# Altium schematic sheet FK723MK1_ZGT6_DSUB.SchDoc: =SAP_Nr_Baugruppe
size A3; Organization: TRUMPF Laser Marking Systems AG; Address1: Trumpf Strasse 8; Address2: CH-7214 Grüsch; Revision: 00; SheetNumber: 1; SheetTotal: 1; Date: 19.03.2018; Author: 19.03.2018; SPICEModelCacheDGJBQTKQ: <root> / <DocumentId>DGJBQTKQ</DocumentId> / <CacheFrame Number="0"> / <Model Name="0603_885012006014_1nf" Kind="CKT"> / <Text>******* / .subckt 0603_885012006014_1nF 1 2 / Rser 1 3 0.0434067925003 / Lser 2 4 4.09321859E-10 / C1 3 4 0.000000001 / Rpar 3 4 10000000000 / .ends 0603_885012006014_1nF</Text> / </Model> / </CacheFrame> / </root>; Time: 19.03.2018
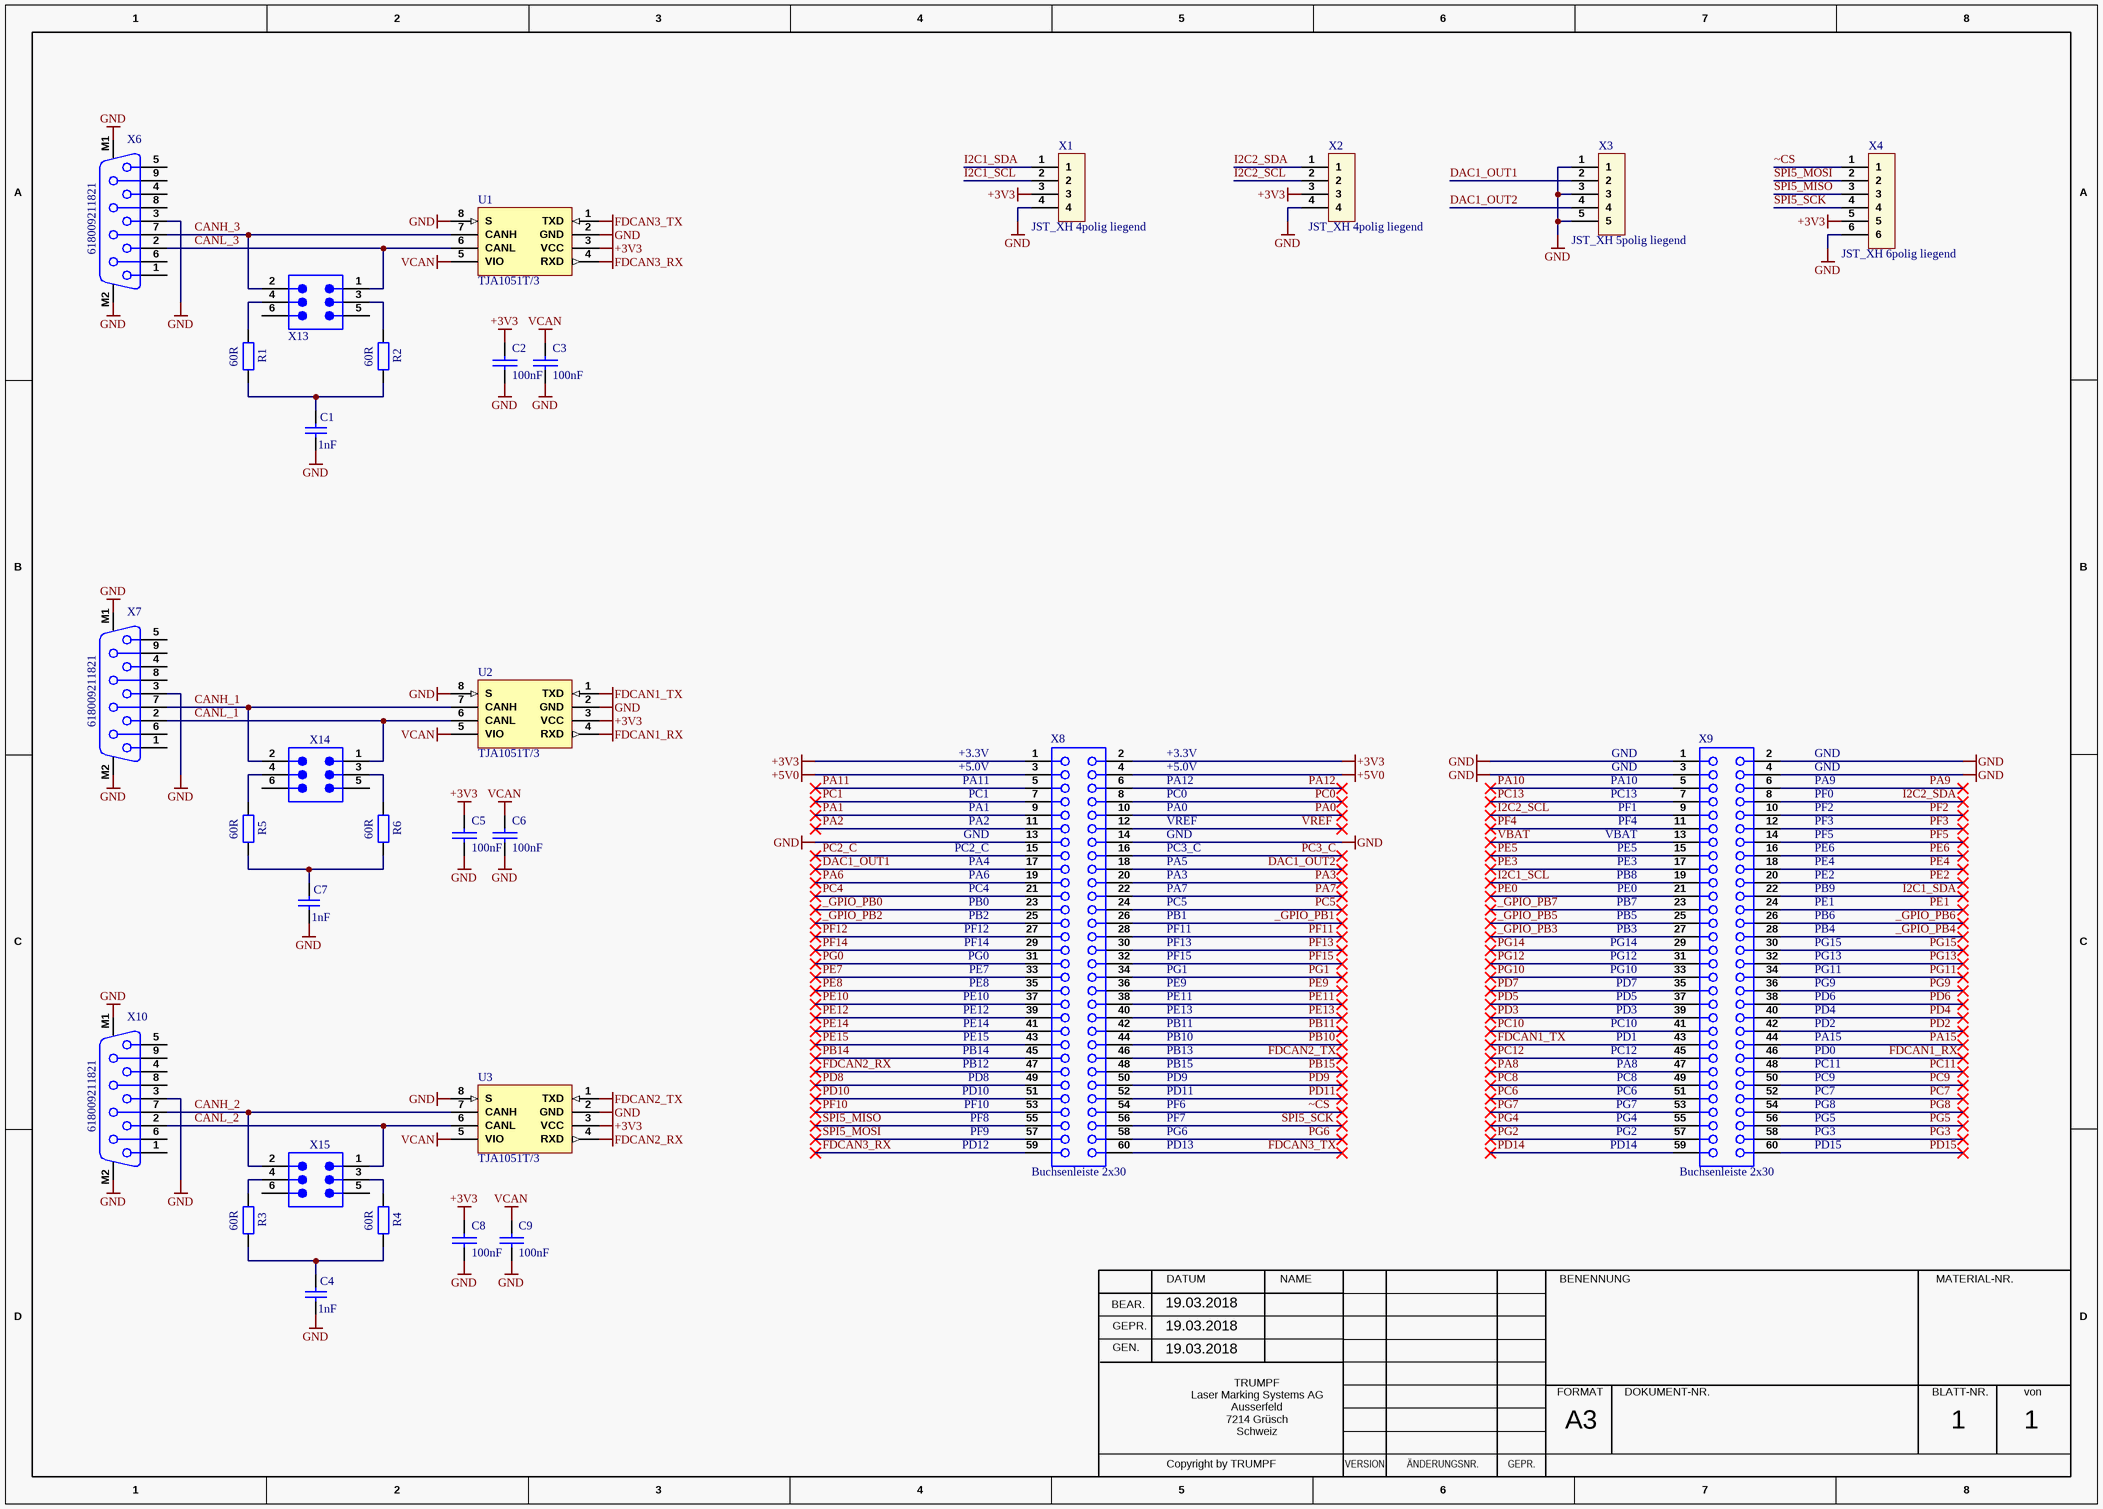
[diagram p0: FK723MK1_ZGT6_DSUB.SchDoc]

## Parts
C1  1nF  [WCAP-CSGP_0603_L1.6W0.8H0.8_Reflow]
C2  100nF  [0402]
C3  100nF  [0402]
C4  1nF  [WCAP-CSGP_0603_L1.6W0.8H0.8_Reflow]
C5  100nF  [0402]
C6  100nF  [0402]
C7  1nF  [WCAP-CSGP_0603_L1.6W0.8H0.8_Reflow]
C8  100nF  [0402]
C9  100nF  [0402]
R1  60R  [WRIS-KSKE_0805]
R2  60R  [WRIS-KSKE_0805]
R3  60R  [WRIS-KSKE_0805]
R4  60R  [WRIS-KSKE_0805]
R5  60R  [WRIS-KSKE_0805]
R6  60R  [WRIS-KSKE_0805]
U1  TJA1051T/3  [SO-8]
U2  TJA1051T/3  [SO-8]
U3  TJA1051T/3  [SO-8]
X1  JST_XH 4polig liegend  [JST_XH 4polig, liegend]
X2  JST_XH 4polig liegend  [JST_XH 4polig, liegend]
X3  JST_XH 5polig liegend  [JST_XH 5polig, liegend]
X4  JST_XH 6polig liegend  [JST_XH 6polig, liegend]
X6  618009211821  [618009211821]
X7  618009211821  [618009211821]
X8  Buchsenleiste 2x30  [Buchsenleiste 2x30polig]
X9  Buchsenleiste 2x30  [Buchsenleiste 2x30polig]
X10  618009211821  [618009211821]
X13  61300621121  [61300621121]  (value not drawn)
X14  61300621121  [61300621121]  (value not drawn)
X15  61300621121  [61300621121]  (value not drawn)

## Nets
+3V3: C2.1 C5.1 C8.1 U1.3(VCC) U2.3(VCC) U3.3(VCC) X1.3 X2.3 X4.5 X8.1 X8.2
+5V0: X8.3 X8.4
FDCAN1_RX: U2.4(RXD) X9.46
FDCAN1_TX: U2.1(TXD) X9.43
FDCAN2_RX: U3.4(RXD) X8.47
FDCAN2_TX: U3.1(TXD) X8.46
FDCAN3_RX: U1.4(RXD) X8.59
FDCAN3_TX: U1.1(TXD) X8.60
GND: C1.1 C2.2 C3.2 C4.1 C5.2 C6.2 C7.1 C8.2 C9.2 U1.2(GND) U1.8(S) U2.2(GND) U2.8(S) U3.2(GND) U3.8(S) X1.4 X2.4 X3.1 X3.3 X3.5 X4.6 X6.3 X6.M1 X6.M2 X7.3 X7.M1 X7.M2 X8.13 X8.14 X9.1 X9.2 X9.3 X9.4 X10.3 X10.M1 X10.M2
VCAN: C3.1 C6.1 C9.1 U1.5(VIO) U2.5(VIO) U3.5(VIO)
_GPIO_PB0: X8.23
_GPIO_PB1: X8.26
_GPIO_PB2: X8.25
_GPIO_PB3: X9.27
_GPIO_PB4: X9.28
_GPIO_PB5: X9.25
_GPIO_PB6: X9.26
_GPIO_PB7: X9.23
CANH_1: U2.7(CANH) X7.7 X14.2
CANH_2: U3.7(CANH) X10.7 X15.2
CANH_3: U1.7(CANH) X6.7 X13.2
CANL_1: U2.6(CANL) X7.2 X14.1
CANL_2: U3.6(CANL) X10.2 X15.1
CANL_3: U1.6(CANL) X6.2 X13.1
DAC1_OUT1: X3.2 X8.17
DAC1_OUT2: X3.4 X8.18
I2C1_SCL: X1.2 X9.19
I2C1_SDA: X1.1 X9.22
I2C2_SCL: X2.2 X9.9
I2C2_SDA: X2.1 X9.8
PA0: X8.10
PA1: X8.9
PA2: X8.11
PA3: X8.20
PA6: X8.19
PA7: X8.22
PA8: X9.47
PA9: X9.6
PA10: X9.5
PA11: X8.5
PA12: X8.6
PA15: X9.44
PB10: X8.44
PB11: X8.42
PB14: X8.45
PB15: X8.48
PC0: X8.8
PC1: X8.7
PC2_C: X8.15
PC3_C: X8.16
PC4: X8.21
PC5: X8.24
PC6: X9.51
PC7: X9.52
PC8: X9.49
PC9: X9.50
PC10: X9.41
PC11: X9.48
PC12: X9.45
PC13: X9.7
PD2: X9.42
PD3: X9.39
PD4: X9.40
PD5: X9.37
PD6: X9.38
PD7: X9.35
PD8: X8.49
PD9: X8.50
PD10: X8.51
PD11: X8.52
PD14: X9.59
PD15: X9.60
PE0: X9.21
PE1: X9.24
PE2: X9.20
PE3: X9.17
PE4: X9.18
PE5: X9.15
PE6: X9.16
PE7: X8.33
PE8: X8.35
PE9: X8.36
PE10: X8.37
PE11: X8.38
PE12: X8.39
PE13: X8.40
PE14: X8.41
PE15: X8.43
PF2: X9.10
PF3: X9.12
PF4: X9.11
PF5: X9.14
PF10: X8.53
PF11: X8.28
PF12: X8.27
PF13: X8.30
PF14: X8.29
PF15: X8.32
PG0: X8.31
PG1: X8.34
PG2: X9.57
PG3: X9.58
PG4: X9.55
PG5: X9.56
PG6: X8.58
PG7: X9.53
PG8: X9.54
PG9: X9.36
PG10: X9.33
PG11: X9.34
PG12: X9.31
PG13: X9.32
PG14: X9.29
PG15: X9.30
SPI5_MISO: X4.3 X8.55
SPI5_MOSI: X4.2 X8.57
SPI5_SCK: X4.4 X8.56
VBAT: X9.13
VREF: X8.12
~CS: X4.1 X8.54
NetC1_2: C1.2 R1.1 R2.1
NetC4_2: C4.2 R3.1 R4.1
NetC7_2: C7.2 R5.1 R6.1
NetR1_2: R1.2 X13.4
NetR2_2: R2.2 X13.3
NetR3_2: R3.2 X15.4
NetR4_2: R4.2 X15.3
NetR5_2: R5.2 X14.4
NetR6_2: R6.2 X14.3

Not connected (* = marked no-connect by the designer): X6 1 4 5 6 8 9; X7 1 4 5 6 8 9; X10 1 4 5 6 8 9; X13 5 6; X14 5 6; X15 5 6

## Notes on the sheet
- PA11
- +3.3V
- +5.0V
- PA12
- PA10
- GND
- PA9
- PC1
- PA1
- PA2
- PC2_C
- PC0
- PA0
- VREF
- PC3_C
- PC13
- PF1
- PF4
- VBAT
- PE5
- PF0
- PF2
- PF3
- PF5
- PE6
- PA4
- PA6
- PC4
- PB0
- PB2
- PA5
- PA3
- PA7
- PC5
- PB1
- PE3
- PB8
- PE0
- PB7
- PB5
- PE4
- PE2
- PB9
- PE1
- PB6
- PF12
- PF14
- PG0
- PE7
- PE8
- PF11
- PF13
- PF15
- PG1
- PE9
- PB3
- PG14
- PG12
- PG10
- PD7
- PB4
- PG15
- PG13
- PG11
- PG9
- PE10
- PE12
- PE14
- PE15
- PB14
- PE11
- PE13
- PB11
- PB10
- PB13
- PD5
- PD3
- PC10
- PD1
- PC12
- PD6
- PD4
- PD2
- PA15
- PD0
- PB12
- PD8
- PD10
- PF10
- PF8
- PB15
- PD9
- PD11
- PF6
- PF7
- PA8
- PC8
- PC6
- PG7
- PG4
- PC11
- PC9
- PC7
- PG8
- PG5
- PF9
- PD12
- PG6
- PD13
- PG2
- PD14
- PG3
- PD15
- BEAR.
- GEPR.
- DATUM
- NAME
- BENENNUNG
- MATERIAL-NR.
- GEN.
- FORMAT
- DOKUMENT-NR.
- BLATT-NR.
- von
- TRUMPF
  Laser Marking Systems AG
  Ausserfeld
  7214 Grüsch
  Schweiz
- A3
- Copyright by TRUMPF
- VERSION
- ÄNDERUNGSNR.

## Library data of the parts
C1 C4 C7 = 885012006014: WCAP-CSGP Multilayer Ceramic Chip Capacitor, General Purpose, size 0603, 1nF, 10V; Manufacturer: Wurth Elektronik; Case/Size Code: 0603; Capacitance Tolerance: +/-5%; Ceramic Type: NP0; Insulation Resistance: 10GΩ; Q Factor: 1000; Technical Reference: NP00603102J010DFCT10000; Manufacturer Part Number: 885012006014; Category: Multilayer Ceramic Chip Capacitors; Match Code: WCAP-CSGP; ComponentLink1Description: Website Link; ComponentLink1URL: https://www.we-online.com/redexpert/article/885012006014?ad; ComponentLink2Description: Datasheet Link; ComponentLink2URL: https://www.we-online.com/redexpert/spec/885012006014?ad; Mount: Surface Mount; Min Operating Temperature: -55°C; Max Operating Temperature: 125°C; Packaging: Tape and Reel; Length: 1.6mm; Width: 0.8mm; Height: 0.8mm; Capacitance: 1nF; Rated Voltage (DC): 10V
C2 C3 C5 C6 C8 C9 = 100nF: 100nF 16V 10% 0402; Trumpf Nr.: 1606554
R1-R6 = 560050320001: WRIS-KSKE Thick Film Resistor, SMT, size 0805, 0.1Ω, 0.33W, +/-1%; Manufacturer: Wurth Elektronik; Case/Size Code: 0805; Rated Current: 1.81A; Temperature Coefficient of Resistance Max: 250ppm/°C; Manufacturer Part Number: 560050320001; Category: Thick Film Resistors; Match Code: WRIS-KSKE; ComponentLink1Description: Website Link; ComponentLink1URL: https://www.we-online.com/redexpert/article/560050320001?ad; ComponentLink2Description: Datasheet Link; ComponentLink2URL: https://www.we-online.com/redexpert/spec/560050320001?ad; Mount: Surface Mount; Min Operating Temperature: -55°C; Max Operating Temperature: 155°C; Packaging: Tape and Reel; Length: 2mm; Width: 1.25mm; Height: 0.6mm; Rated Power: 0.33W; Resistance: 0.1Ω; Resistance Tolerance: +/-1%
X1 X2 = JST_XH 4polig
X3 = JST_XH 5polig
X4 = JST_XH 6polig
X6 X7 X10 = 618009211821: WR-DSUB 8.08mm Female PCB Connector without Hex Screw, THT, Angled, 9p; Manufacturer: Wurth Elektronik; Contact Resistance: 30mΩ; Rated Current: 3A; Working Voltage: 125V (AC); Withstanding Voltage: 1000V (AC); Manufacturer Part Number: 618009211821; Category: Input/Output Connector; Match Code: WR-DSUB; ComponentLink1Description: Website Link; ComponentLink1URL: https://www.we-online.com/redexpert/article/618009211821?ad; ComponentLink2Description: Datasheet Link; ComponentLink2URL: https://www.we-online.com/redexpert/spec/618009211821?ad; Mount: Through Hole; Min Operating Temperature: -55°C; Max Operating Temperature: 105°C; Packaging: Tray; Number of Pins: 9; Gender: Female; Orientation: Angled
X13-X15 = 61300621121: WR-PHD Pin Header, THT, Vertical, pitch 2.54mm, 2 Row, 6P; Manufacturer: Wurth Elektronik; Contact Resistance: 20mOhm; Rated Current: 3A; Working Voltage: 250V; Withstanding Voltage: 500V; Manufacturer Part Number: 61300621121; Category: Board-to-Board Connectors; Match Code: WR-PHD; ComponentLink1Description: Website Link; ComponentLink1URL: https://www.we-online.com/redexpert/article/61300621121?ad; ComponentLink2Description: Datasheet Link; ComponentLink2URL: https://www.we-online.com/redexpert/spec/61300621121?ad; Mount: Through Hole; Operating Temperature Max: 105°C; Operating Temperature Min: -40°C; Packaging: Bag; Gender: Pin Header; Number of Pins: 6; Number of Rows: 2; Orientation: Vertical; Pitch: 2.54mm